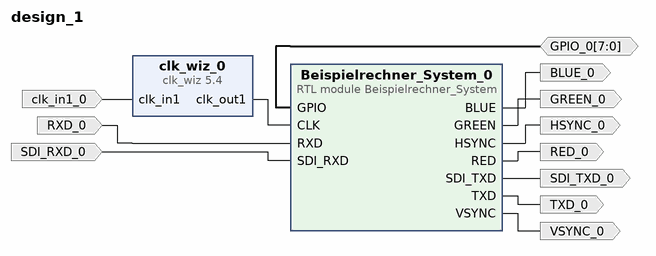
[diagram p0: block diagram of the top level]
# Vivado block design design_1, xc7a35tcpg236-1, Vivado 2017.4
create_bd_design design_1

create_bd_port -dir I RXD_0
create_bd_port -dir I SDI_RXD_0
create_bd_port -dir IO -from 7 -to 0 GPIO_0
create_bd_port -dir O TXD_0
create_bd_port -dir O SDI_TXD_0
create_bd_port -dir I -type clk clk_in1_0
set_property -dict {CONFIG.FREQ_HZ 12000000} [get_bd_ports clk_in1_0]
create_bd_port -dir O VSYNC_0
create_bd_port -dir O HSYNC_0
create_bd_port -dir O RED_0
create_bd_port -dir O GREEN_0
create_bd_port -dir O BLUE_0

create_bd_cell -type ip -vlnv xilinx.com:ip:clk_wiz:5.4 clk_wiz_0
set_property -dict [list \
  CONFIG.CLKOUT1_REQUESTED_OUT_FREQ 50 \
  CONFIG.USE_LOCKED false \
  CONFIG.USE_RESET false \
  CONFIG.MMCM_DIVCLK_DIVIDE 1 \
  CONFIG.MMCM_CLKOUT0_DIVIDE_F 15.000 \
  CONFIG.CLKOUT1_JITTER 522.315 \
] [get_bd_cells clk_wiz_0]
create_bd_cell -type module -reference Beispielrechner_System Beispielrechner_System_0

# ---- connections ----

connect_bd_net [get_bd_pins clk_wiz_0/clk_out1] [get_bd_pins Beispielrechner_System_0/CLK]
connect_bd_net -net RXD_0_1 [get_bd_ports RXD_0] [get_bd_pins Beispielrechner_System_0/RXD]
connect_bd_net -net SDI_RXD_0_1 [get_bd_ports SDI_RXD_0] [get_bd_pins Beispielrechner_System_0/SDI_RXD]
connect_bd_net [get_bd_ports GPIO_0] [get_bd_pins Beispielrechner_System_0/GPIO]
connect_bd_net [get_bd_pins Beispielrechner_System_0/TXD] [get_bd_ports TXD_0]
connect_bd_net [get_bd_pins Beispielrechner_System_0/SDI_TXD] [get_bd_ports SDI_TXD_0]
connect_bd_net -net clk_in1_0_1 [get_bd_ports clk_in1_0] [get_bd_pins clk_wiz_0/clk_in1]
connect_bd_net [get_bd_pins Beispielrechner_System_0/VSYNC] [get_bd_ports VSYNC_0]
connect_bd_net [get_bd_pins Beispielrechner_System_0/HSYNC] [get_bd_ports HSYNC_0]
connect_bd_net [get_bd_pins Beispielrechner_System_0/RED] [get_bd_ports RED_0]
connect_bd_net [get_bd_pins Beispielrechner_System_0/GREEN] [get_bd_ports GREEN_0]
connect_bd_net [get_bd_pins Beispielrechner_System_0/BLUE] [get_bd_ports BLUE_0]

validate_bd_design
save_bd_design
